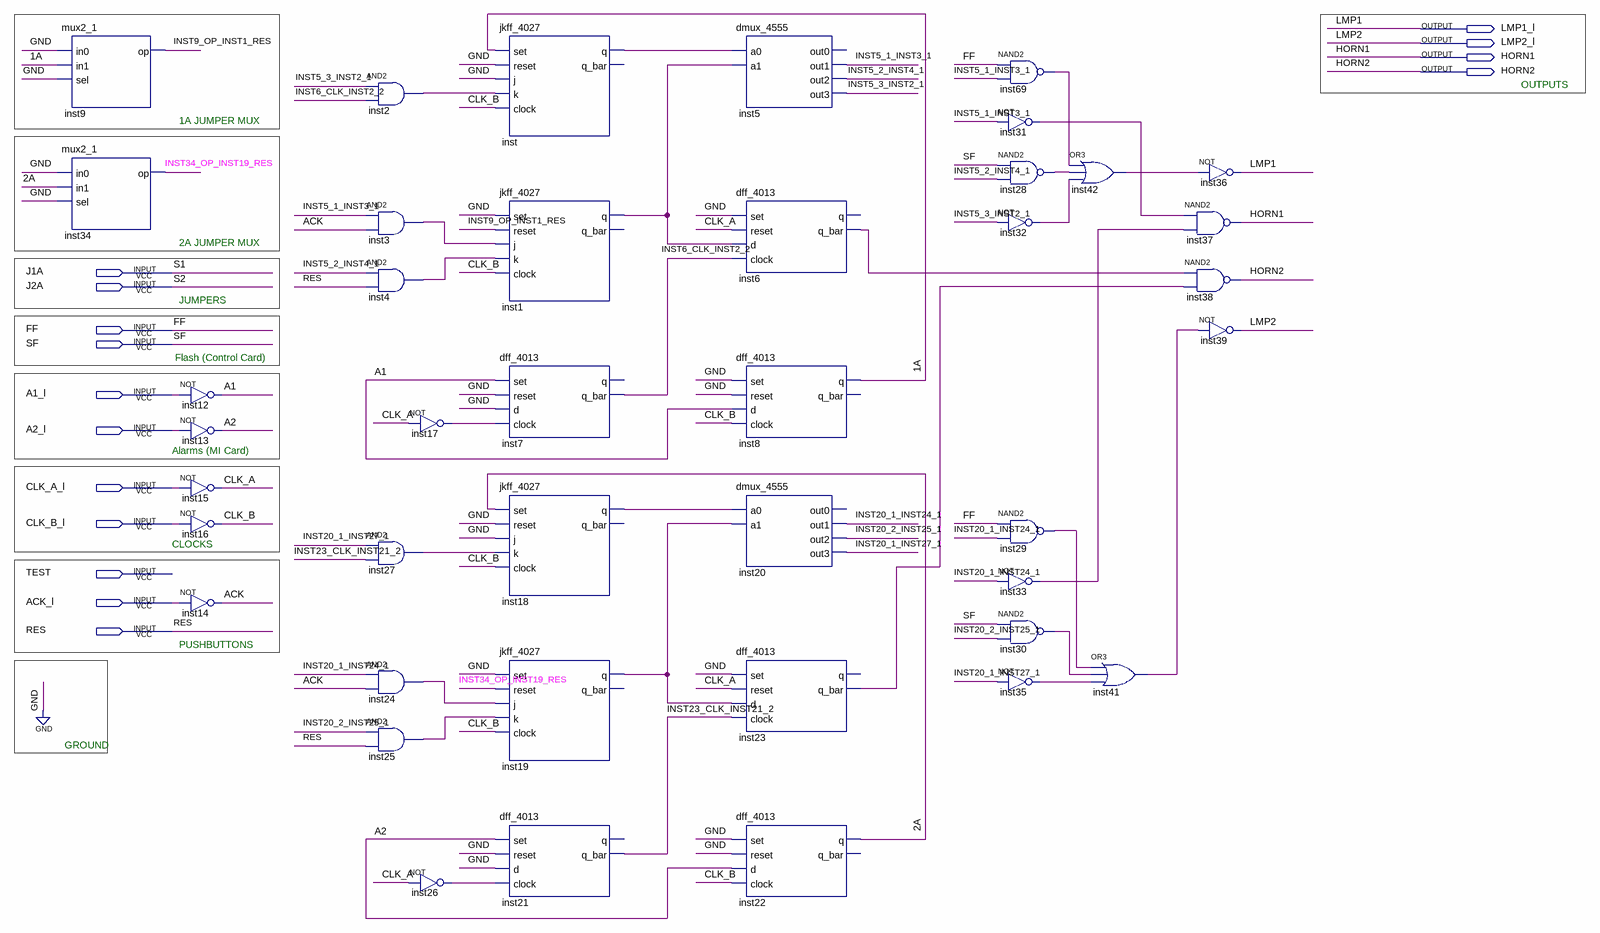
[diagram p0: schematic sheet]
// Quartus schematic mi_logic.bdf as structural Verilog: 41 symbols, 15 pins
module mi_logic (
  input  J1A,
  input  J2A,
  input  FF,
  input  SF,
  input  A1_l,
  input  A2_l,
  input  CLK_A_l,
  input  CLK_B_l,
  input  TEST,
  input  ACK_l,
  input  RES,
  output LMP1_l,
  output LMP2_l,
  output HORN1,
  output HORN2
);

  wire \1A , \2A , A1, A2, ACK, CLK_A, CLK_B, inst1_q, inst2_out, inst3_out, inst4_out, INST5_1_INST3_1,
       INST5_2_INST4_1, INST5_3_INST2_1, INST6_CLK_INST2_2, inst6_q_bar, INST9_OP_INST1_RES, inst17_out,
       inst18_q, inst19_q, INST20_1_INST24_1, INST20_1_INST27_1, INST20_2_INST25_1, INST23_CLK_INST21_2,
       inst23_q_bar, inst24_out, inst25_out, inst26_out, inst27_out, inst28_out, inst29_out, inst30_out,
       inst31_out, inst32_out, inst33_out, INST34_OP_INST19_RES, inst35_out, inst41_out, inst42_out,
       inst69_out, inst_q;

  mux2_1 inst9 (.in0(1'b0), .in1(\1A ), .sel(1'b0), .op(INST9_OP_INST1_RES));
  mux2_1 inst34 (.in0(1'b0), .in1(\2A ), .sel(1'b0), .op(INST34_OP_INST19_RES));
  not inst12 (A1, A1_l);
  not inst13 (A2, A2_l);
  not inst15 (CLK_A, CLK_A_l);
  not inst16 (CLK_B, CLK_B_l);
  not inst14 (ACK, ACK_l);
  and inst2 (inst2_out, INST5_3_INST2_1, INST6_CLK_INST2_2);
  and inst3 (inst3_out, INST5_1_INST3_1, ACK);
  and inst4 (inst4_out, INST5_2_INST4_1, RES);
  and inst27 (inst27_out, INST20_1_INST27_1, INST23_CLK_INST21_2);
  and inst24 (inst24_out, INST20_1_INST24_1, ACK);
  and inst25 (inst25_out, INST20_2_INST25_1, RES);
  not inst17 (inst17_out, CLK_A);
  not inst26 (inst26_out, CLK_A);
  jkff_4027 inst (.set(\1A ), .reset(1'b0), .j(1'b0), .k(inst2_out), .clock(CLK_B), .q(inst_q));  // open: q_bar
  jkff_4027 inst1 (
    .set(1'b0), .reset(INST9_OP_INST1_RES), .j(inst3_out), .k(inst4_out), .clock(CLK_B), .q(inst1_q));  // open: q_bar
  dff_4013 inst7 (.set(A1), .reset(1'b0), .d(1'b0), .clock(inst17_out), .q_bar(INST6_CLK_INST2_2));  // open: q
  jkff_4027 inst18 (.set(\2A ), .reset(1'b0), .j(1'b0), .k(inst27_out), .clock(CLK_B), .q(inst18_q));  // open: q_bar
  jkff_4027 inst19 (
    .set(1'b0), .reset(INST34_OP_INST19_RES), .j(inst24_out), .k(inst25_out), .clock(CLK_B), .q(inst19_q));  // open: q_bar
  dff_4013 inst21 (.set(A2), .reset(1'b0), .d(1'b0), .clock(inst26_out), .q_bar(INST23_CLK_INST21_2));  // open: q
  dmux_4555 inst5 (
    .a0(inst_q), .a1(inst1_q), .out1(INST5_1_INST3_1), .out2(INST5_2_INST4_1), .out3(INST5_3_INST2_1));  // open: out0
  dff_4013 inst6 (.set(1'b0), .reset(CLK_A), .d(inst1_q), .clock(INST6_CLK_INST2_2), .q_bar(inst6_q_bar));  // open: q
  dff_4013 inst8 (.set(1'b0), .reset(1'b0), .d(A1), .clock(CLK_B), .q(\1A ));  // open: q_bar
  dmux_4555 inst20 (
    .a0(inst18_q), .a1(inst19_q), .out1(INST20_1_INST24_1), .out2(INST20_2_INST25_1), .out3(INST20_1_INST27_1));  // open: out0
  dff_4013 inst23 (
    .set(1'b0), .reset(CLK_A), .d(inst19_q), .clock(INST23_CLK_INST21_2), .q_bar(inst23_q_bar));  // open: q
  dff_4013 inst22 (.set(1'b0), .reset(1'b0), .d(A2), .clock(CLK_B), .q(\2A ));  // open: q_bar
  nand inst69 (inst69_out, FF, INST5_1_INST3_1);
  not inst31 (inst31_out, INST5_1_INST3_1);
  nand inst28 (inst28_out, SF, INST5_2_INST4_1);
  not inst32 (inst32_out, INST5_3_INST2_1);
  nand inst29 (inst29_out, FF, INST20_1_INST24_1);
  not inst33 (inst33_out, INST20_1_INST24_1);
  nand inst30 (inst30_out, SF, INST20_2_INST25_1);
  not inst35 (inst35_out, INST20_1_INST27_1);
  or inst42 (inst42_out, inst69_out, inst28_out, inst32_out);
  or inst41 (inst41_out, inst29_out, inst30_out, inst35_out);
  nand inst37 (HORN1, inst31_out, inst33_out);
  nand inst38 (HORN2, inst6_q_bar, inst23_q_bar);
  not inst36 (LMP1_l, inst42_out);
  not inst39 (LMP2_l, inst41_out);

  // Other names for the same wires on the sheet: LMP1 = LMP1_l; LMP2 = LMP2_l; S1 = J1A; S2 = J2A

  // Notes on the sheet:
  //   OUTPUTS
  //   1A JUMPER MUX
  //   2A JUMPER MUX
  //   JUMPERS
  //    Flash (Control Card)
  //   Alarms (MI Card)
  //   CLOCKS
  //   PUSHBUTTONS
  //   GROUND
endmodule
